# EAGLE design cylonite (EAGLE 7.2.0)
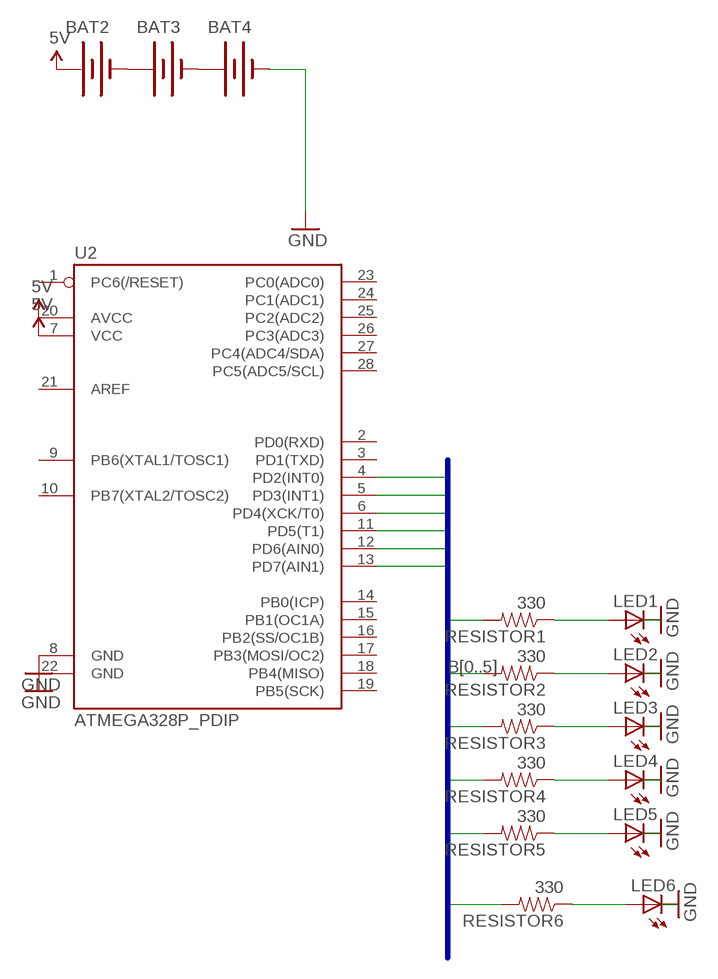
[diagram p0: schematic, sheet 1]

## Parts
BAT2  BATTERYAA  [BATTERY-AA]
BAT3  BATTERYAA  [BATTERY-AA]
BAT4  BATTERYAA  [BATTERY-AA]
LED1  LED5MM  [LED5MM]
LED2  LED5MM  [LED5MM]
LED3  LED5MM  [LED5MM]
LED4  LED5MM  [LED5MM]
LED5  LED5MM  [LED5MM]
LED6  LED5MM  [LED5MM]
RESISTOR1  330  RESISTORPTH-1/4W  [AXIAL-0.4]
RESISTOR2  330  RESISTORPTH-1/4W  [AXIAL-0.4]
RESISTOR3  330  RESISTORPTH-1/4W  [AXIAL-0.4]
RESISTOR4  330  RESISTORPTH-1/4W  [AXIAL-0.4]
RESISTOR5  330  RESISTORPTH-1/4W  [AXIAL-0.4]
RESISTOR6  330  RESISTORPTH-1/4W  [AXIAL-0.4]
U2  ATMEGA328P_PDIP  [DIL28-3]

## Nets
5V: BAT2.PWR@1(+) U2.7(VCC) U2.20(AVCC)
B0: RESISTOR1.P$2 U2.4(PD2(INT0))
B1: RESISTOR2.P$2 U2.5(PD3(INT1))
B2: RESISTOR3.P$2 U2.6(PD4(XCK/T0))
B3: RESISTOR4.P$2 U2.11(PD5(T1))
B4: RESISTOR5.P$2 U2.12(PD6(AIN0))
B5: RESISTOR6.P$2 U2.13(PD7(AIN1))
GND: BAT4.GND@1(-) LED1.K(C) LED2.K(C) LED3.K(C) LED4.K(C) LED5.K(C) LED6.K(C) U2.8(GND) U2.22(GND)
N$1: LED1.A RESISTOR1.P$1
N$2: LED2.A RESISTOR2.P$1
N$3: LED6.A RESISTOR6.P$1
N$4: BAT2.GND@1(-) BAT3.PWR@1(+)
N$5: LED3.A RESISTOR3.P$1
N$6: BAT3.GND@1(-) BAT4.PWR@1(+)
N$7: LED4.A RESISTOR4.P$1
N$9: LED5.A RESISTOR5.P$1
Unconnected: U2.1(PC6(/RESET)) U2.2(PD0(RXD)) U2.3(PD1(TXD)) U2.9(PB6(XTAL1/TOSC1)) U2.10(PB7(XTAL2/TOSC2)) U2.14(PB0(ICP)) U2.15(PB1(OC1A)) U2.16(PB2(SS/OC1B)) U2.17(PB3(MOSI/OC2)) U2.18(PB4(MISO)) U2.19(PB5(SCK)) U2.21(AREF) U2.23(PC0(ADC0)) U2.24(PC1(ADC1)) U2.25(PC2(ADC2)) U2.26(PC3(ADC3)) U2.27(PC4(ADC4/SDA)) U2.28(PC5(ADC5/SCL))

## Buses
B[0..5]

## Library data of the parts
BAT2-BAT4 = SparkFun-Electromechanical:BATTERY: Battery Holders Various common sizes : AA, AAA, 18650 (PRT-12895), 20mm coin cell and 12mm coin cell. 20MM_4LEGS, BATT-10373
LED1-LED6 = adafruit:LED: LED OSRAM: - CHIPLED LG R971, LG N971, LY N971, LG Q971, LY Q971, LO R971, LY R971 LH N974, LH R974 LS Q976, LO Q976, LY Q976 LO Q996 - Hyper CHIPLED LW Q18S LB Q993, LB Q99A, LB R99A - SideLED LS A670, LO A670, LY A670, LG A670, LP A670 LB A673, LV A673, LT A673, LW A673 LH A674 LY A675 LS A676, LA A676, LO A676, LY A676, LW A676 LS A679, LY A679, LG A679 - Hyper Micro SIDELED® LS Y876, LA Y876, LO Y876, LY Y876 LT Y87S - SmartLED LW L88C, LW L88S LB L89C, LB L89S, LG L890 LS L89K, LO L89K, LY L89K LS L896, LA L896, LO L896, LY L896 - TOPLED LS T670, LO T670, LY T670, LG T670, LP T670 LSG T670, LSP T670, LSY T670, LOP T670, LYG T670 LG T671, LOG T671, LSG T671 LB T673, LV T673, LT T673, LW T673 LH T674 LS T676, LA T676, LO T676, LY T676, LB T676, LH T676, LSB T676, LW T676 LB T67C, LV T67C, LT T67C, LS T67K, LO T67K, LY T67K, LW E67C LS E67B, LA E67B, LO E67B, LY E67B, LB E67C, LV E67C, LT E67C LW T67C LS T679, LY T679, LG T679 LS T770, LO T770, LY T770, LG T770, LP T770 LB T773, LV T773, LT T773, LW T773 LH T774 LS E675, LA E675, LY E675, LS T675 LS T776, LA T776, LO T776, LY T776, LB T776 LHGB T686 LT T68C, LB T68C - Hyper Mini TOPLED® LB M676 - Mini TOPLED Santana® LG M470 LS M47K, LO M47K, LY M47K Source: http://www.osram.convergy.de/
RESISTOR1-RESISTOR6 = SparkFun-Resistors:RESISTOR: Resistor Basic schematic elements and footprints for 0603, 1206, and PTH resistors.
U2 = SparkFun-DigitalIC:ATMEGA328P_PDIP: uC used in the Arduino 32kb flash, 1k EEPROM, 2k SRAM This is the through-hole version of this chip.

## Board
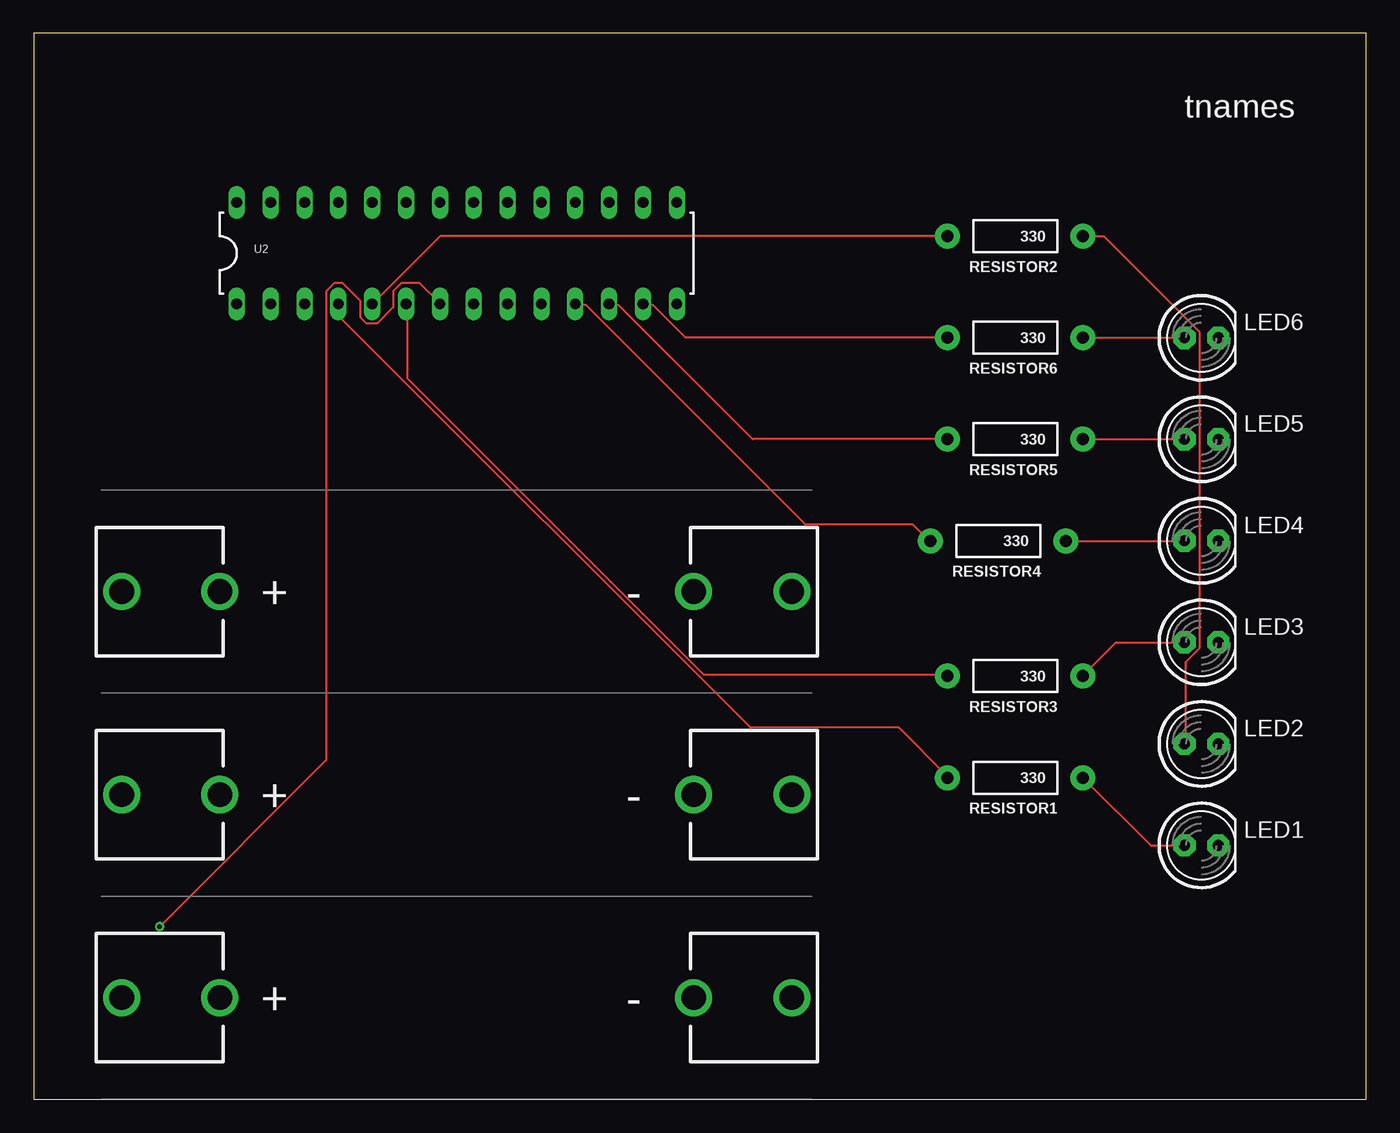
[diagram p1: board, top side]
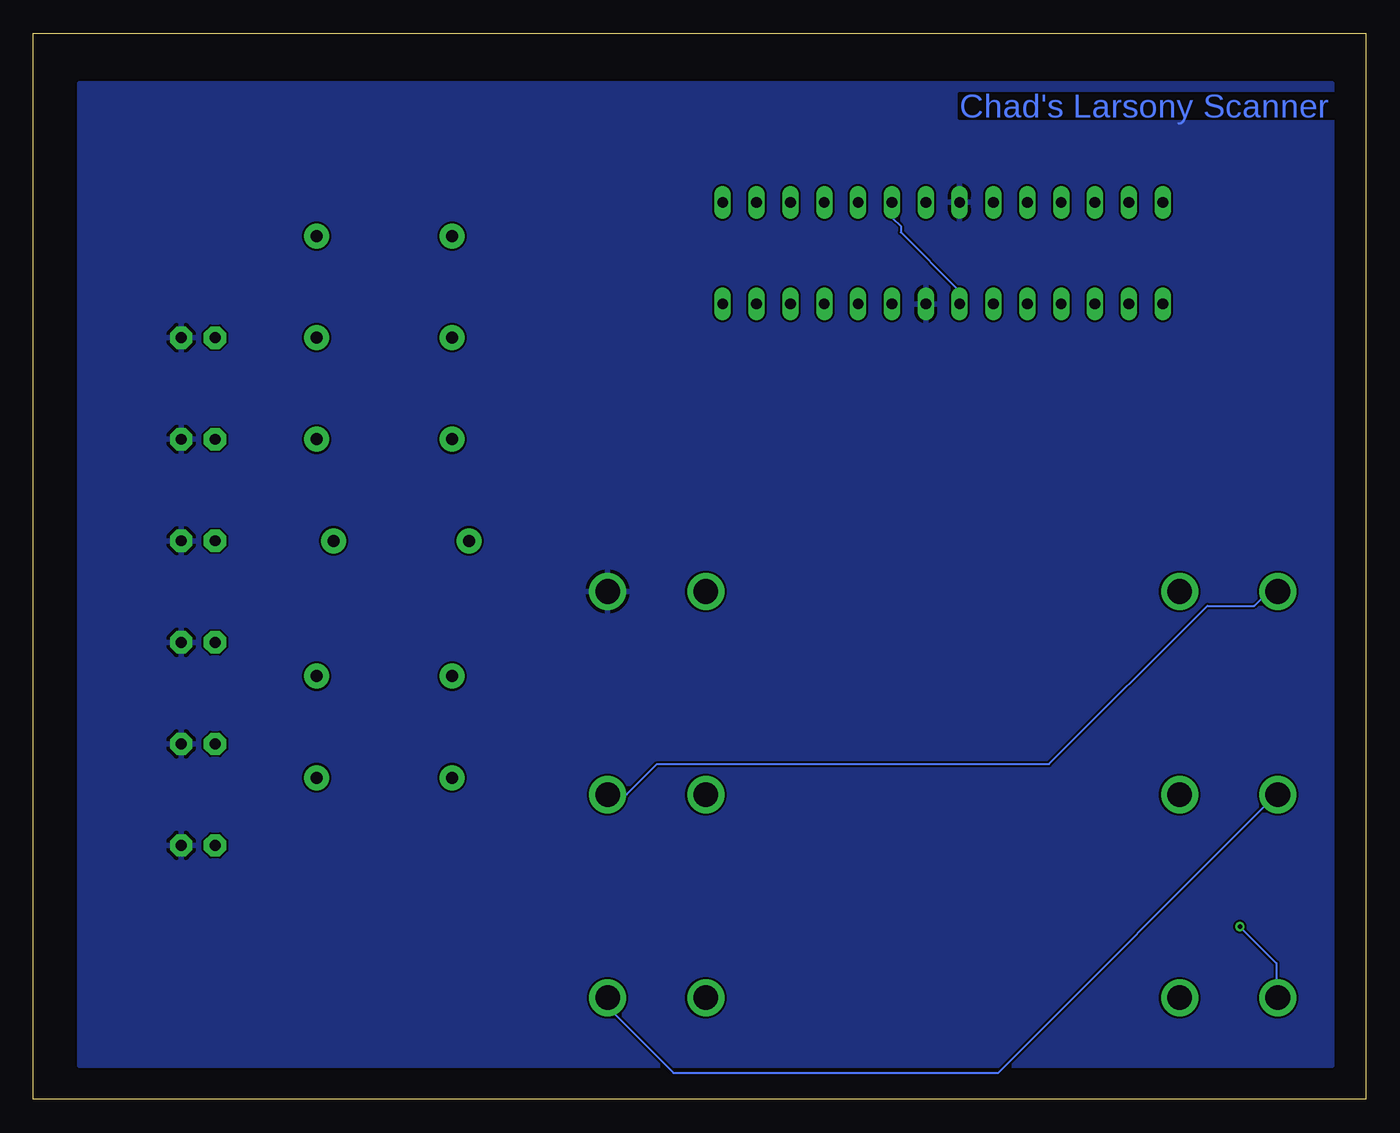
[diagram p2: board, bottom side, seen from below]

Size 100 x 80 mm. Coordinates in mm from the lower left corner, seen from the top.
Outline: 0,0 100,0 100,80 0,80 0,0
Copper layers (1*16): Top 0.0356mm / dielectric 1.5011mm / Bottom 0.0356mm
Design rules "LaenPCBOrder": minimum track width 6mil, minimum drill 13mil, track to track 6mil, track to pad 6mil, pad to pad 6mil, via to via 6mil, smd to smd 6mil, copper to edge 15mil, drill to drill 6mil, minimum pad ring 7mil, minimum via ring 7mil, stop-mask expansion 3mil, vias tented up to drill 0mil, thermal gap 10mil

### Footprints (pad centres in the part's own frame; a part is rotated, then mirrored left to right if it is on the bottom)
BATTERY-AA = drill 1.854: GND@1 25.146,0; GND@2 17.78,0; PWR@1 -25.146,0; PWR@2 -17.78,0
LED5MM = drill 0.813 pad 1.676 octagon: A -1.27,0; K 1.27,0
AXIAL-0.4 = drill 0.9 pad 1.88: P$1 -5.08,0; P$2 5.08,0
DIL28-3 = drill 0.813 long: 1 -16.51,-3.81; 2 -13.97,-3.81; 3 -11.43,-3.81; 4 -8.89,-3.81; 5 -6.35,-3.81; 6 -3.81,-3.81; 7 -1.27,-3.81; 8 1.27,-3.81; 9 3.81,-3.81; 10 6.35,-3.81; 11 8.89,-3.81; 12 11.43,-3.81; 13 13.97,-3.81; 14 16.51,-3.81; 15 16.51,3.81; 16 13.97,3.81; 17 11.43,3.81; 18 8.89,3.81; 19 6.35,3.81; 20 3.81,3.81; 21 1.27,3.81; 22 -1.27,3.81; 23 -3.81,3.81; 24 -6.35,3.81; 25 -8.89,3.81; 26 -11.43,3.81; 27 -13.97,3.81; 28 -16.51,3.81

### Placement (x,y rotation side)
BAT2  31.75,7.62 0 top
BAT3  31.75,22.86 0 top
BAT4  31.75,38.1 0 top
LED1  87.63,19.05 0 top
LED2  87.63,26.67 0 top
LED3  87.63,34.29 0 top
LED4  87.63,41.91 0 top
LED5  87.63,49.53 0 top
LED6  87.63,57.15 0 top
RESISTOR1  73.66,24.13 180 top
RESISTOR2  73.66,64.77 180 top
RESISTOR3  73.66,31.75 180 top
RESISTOR4  72.39,41.91 180 top
RESISTOR5  73.66,49.53 180 top
RESISTOR6  73.66,57.15 180 top
U2  31.75,63.5 0 top

### Tracks (layer width: path | path; a pad name or v marks a point on that pad's centre or on a via)
5V  (via drill 0.33)
  Top 0.152: v9.45,12.95 21.95,25.45 21.95,60.66 22.55,61.27 23.16,61.27 24.54,59.89 24.54,58.67 24.99,58.22 25.76,58.22 26.98,59.44 26.98,60.66 27.58,61.27 28.96,61.27 30.48,59.74 U2.7
  Bottom 0.152: U2.7 30.48,60.66 34.9,65.08 34.9,65.53 35.51,66.14 35.51,67.21 U2.20 | v9.45,12.95 6.71,10.21 6.71,7.62 BAT2.PWR@1
B0
  Top 0.152: U2.4 22.86,58.83 53.8,27.89 64.92,27.89 68.58,24.23 RESISTOR1.P$2
B1
  Top 0.152: U2.5 30.48,64.77 RESISTOR2.P$2
B2
  Top 0.152: U2.6 28.04,59.59 28.04,54.1 50.29,31.85 68.58,31.85 RESISTOR3.P$2
B3
  Top 0.152: U2.11 40.69,59.59 41.45,59.59 57.91,43.13 65.99,43.13 67.21,41.91 RESISTOR4.P$2
B4
  Top 0.152: RESISTOR5.P$2 53.95,49.53 43.89,59.59 43.28,59.59 U2.12
B5
  Top 0.152: RESISTOR6.P$2 48.92,57.15 46.48,59.59 45.72,59.59 U2.13
GND
  pour Bottom: 2.54,76.2 96.52,76.2 96.52,74.93 96.52,2.54 2.54,2.54 2.54,3.81
N$1
  Top 0.152: LED1.A 83.82,19.05 RESISTOR1.P$1
N$2
  Top 0.152: RESISTOR2.P$1 80.31,64.77 87.48,57.61 87.48,33.83 86.41,32.77 86.41,26.67 LED2.A
N$3
  Top 0.152: RESISTOR6.P$1 LED6.A
N$4
  Bottom 0.152: BAT3.PWR@1 6.71,22.86 27.58,1.98 51.97,1.98 56.84,6.86 56.84,7.62 BAT2.GND@1
N$5
  Top 0.152: LED3.A 81.23,34.29 78.79,31.85 RESISTOR3.P$1
N$6
  Bottom 0.152: BAT4.PWR@1 7.32,38.1 8.38,37.03 11.89,37.03 23.77,25.15 53.19,25.15 55.47,22.86 BAT3.GND@1
N$7
  Top 0.152: RESISTOR4.P$1 LED4.A
N$9
  Top 0.152: RESISTOR5.P$1 LED5.A

### Text on the board
Bottom: Chad's Larsony Scanner
tNames: tnames